# Altium project Transmitter.PrjPCB
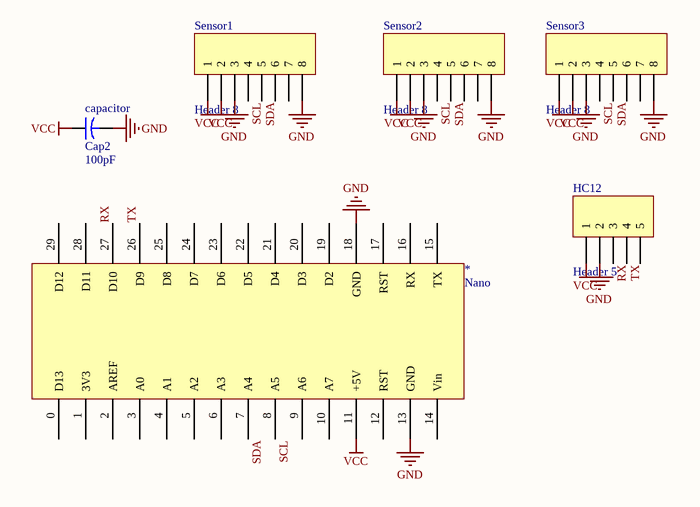
[diagram p0: Transmitter.SchDoc]
1 sheet, 6 parts. Net scope: global (net labels, ports and power ports of the same name join across sheets).
Board file: Transmitter.PcbDoc

## Sheet Transmitter.SchDoc
size A4

### Parts
*  Nano  [ArduinoNano]
capacitor  Cap2  value 100pF  [CAPR5-4X5]
HC12  Header 5  [HDR1X5]
Sensor1  Header 8  [HDR1X8]
Sensor2  Header 8  [HDR1X8]
Sensor3  Header 8  [HDR1X8]

### Nets
GND: *.13(GND) *.18(GND) capacitor.2 HC12.2 Sensor1.3 Sensor1.8 Sensor2.3 Sensor2.8 Sensor3.3 Sensor3.8
VCC: *.11(+5V) capacitor.1 HC12.1 Sensor1.1 Sensor1.2 Sensor2.1 Sensor2.2 Sensor3.1 Sensor3.2
RX: *.27(D10) HC12.3
SCL: *.8(A5) Sensor1.4 Sensor2.4 Sensor3.4
SDA: *.7(A4) Sensor1.5 Sensor2.5 Sensor3.5
TX: *.26(D9) HC12.4

Not connected (* = marked no-connect by the designer): * 0(D13) 1(3V3) 2(AREF) 3(A0) 4(A1) 5(A2) 6(A3) 9(A6) 10(A7) 12(RST) 14(Vin) 15(TX) 16(RX) 17(RST) 19(D2) 20(D3) 21(D4) 22(D5) 23(D6) 24(D7) 25(D8) 28(D11) 29(D12); HC12 5; Sensor1 6 7; Sensor2 6 7; Sensor3 6 7

### Library data of the parts
* = Component_1
capacitor = Cap2: Capacitor; Published: 23-Sep-2002; PackageReference: CAPR5-4X5; Publisher: Altium Limited; PackageDescription: Capacitor; 2 Leads
HC12 = Header 5: Header, 5-Pin; LatestRevisionDate: 17-Jul-2002; LatestRevisionNote: Re-released for DXP Platform.; Publisher: Altium Limited
Sensor1-Sensor3 = Header 8: Header, 8-Pin; LatestRevisionDate: 17-Jul-2002; LatestRevisionNote: Re-released for DXP Platform.; Publisher: Altium Limited